# Altium schematic sheet USB_C.SchDoc
size A3; Organization: Altium Limited; Address1: L3, 12a Rodborough Rd; Address2: Frenchs Forest; Address3: NSW; Address4: Australia 2086
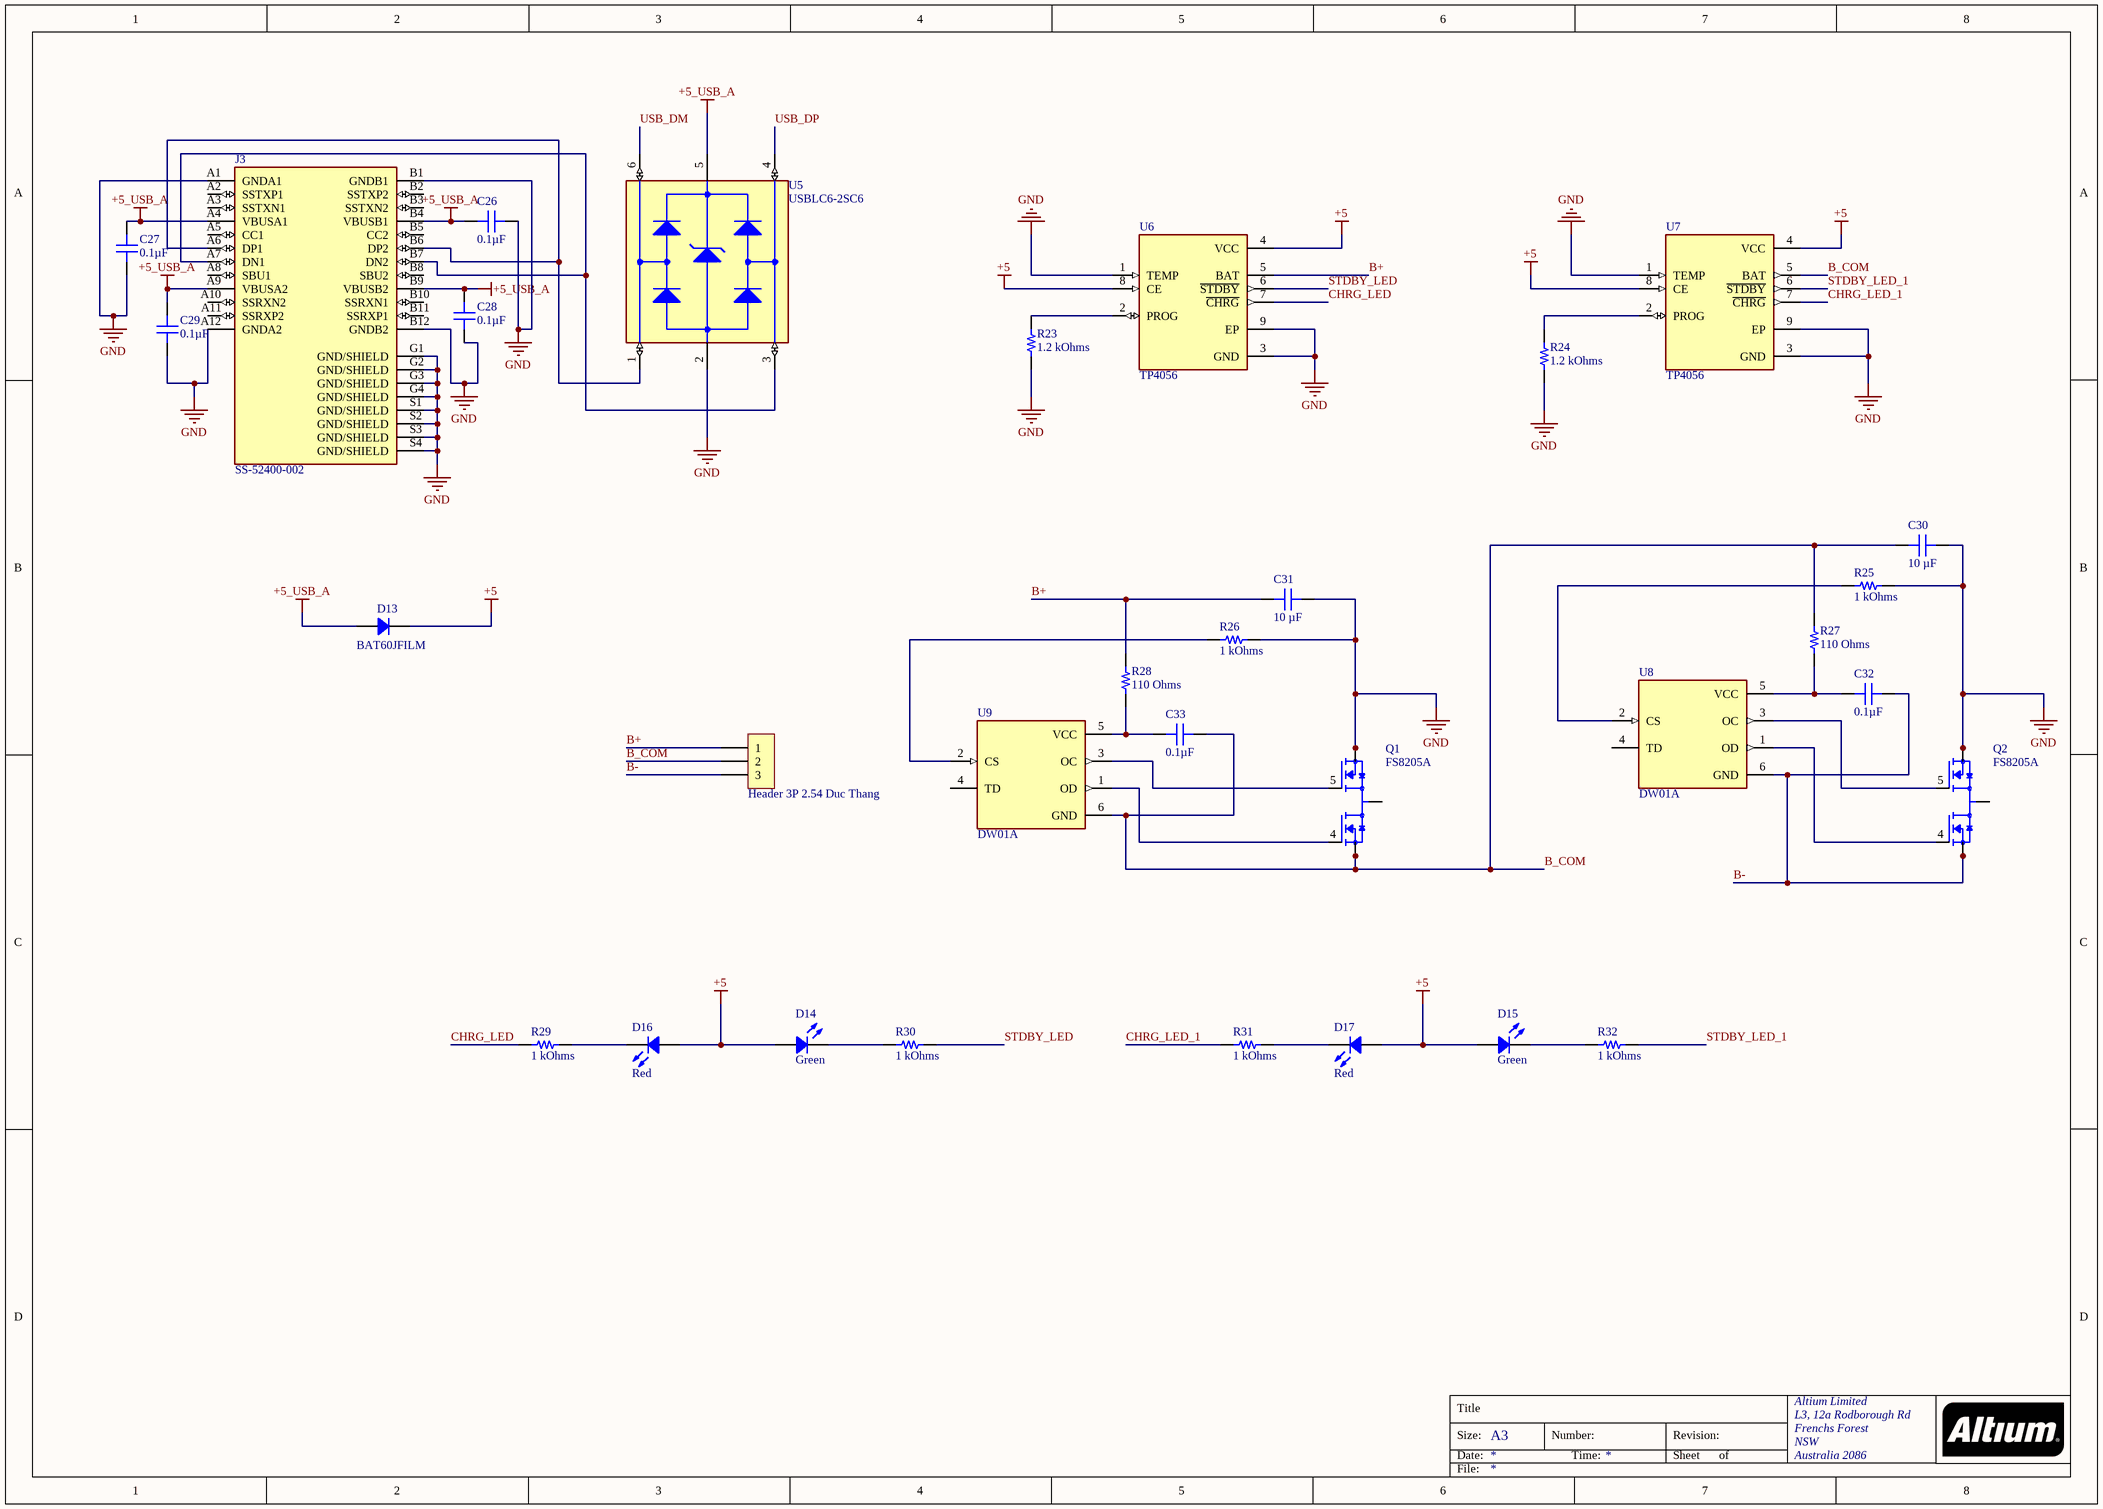
[diagram p0: USB_C.SchDoc]

## Parts
C26  0.1µF  [CAP 0603_1608]
C27  0.1µF  [CAP 0603_1608]
C28  0.1µF  [CAP 0603_1608]
C29  0.1µF  [CAP 0603_1608]
C30  10 µF  [CAP 0603_1608]
C31  10 µF  [CAP 0603_1608]
C32  0.1µF  [CAP 0603_1608]
C33  0.1µF  [CAP 0603_1608]
D13  BAT60JFILM  [SOD323]
D14  Green  [LED 0603_1608 GREEN]
D15  Green  [LED 0603_1608 GREEN]
D16  Red  [LED 0603_1608 RED]
D17  Red  [LED 0603_1608 RED]
H1  Header 3P 2.54 Duc Thang  [XH2.54M-3]
J3  SS-52400-002  [BELFUSE_SS-52400-002]
Q1  FS8205A  [SOP65P640X120-8N]
Q2  FS8205A  [SOP65P640X120-8N]
R23  1.2 kOhms  [RES 0402_1005]
R24  1.2 kOhms  [RES 0402_1005]
R25  1 kOhms  [RES 0603_1608]
R26  1 kOhms  [RES 0603_1608]
R27  110 Ohms  [RES 0603_1608]
R28  110 Ohms  [RES 0603_1608]
R29  1 kOhms  [RES 0603_1608]
R30  1 kOhms  [RES 0603_1608]
R31  1 kOhms  [RES 0603_1608]
R32  1 kOhms  [RES 0603_1608]
U5  USBLC6-2SC6  [SOT95P280X145-6N]
U6  TP4056  [SOP127P600X175-9N]
U7  TP4056  [SOP127P600X175-9N]
U8  DW01A  [SOT95P280X145-6N]
U9  DW01A  [SOT95P280X145-6N]

## Nets
+5: D13.2 D14.1 D15.1 D16.1 D17.1 U6.4(VCC) U6.8(CE) U7.4(VCC) U7.8(CE)
+5_USB_A: C26.2 C27.2 C28.2 C29.2 D13.1 J3.A4(VBUSA1) J3.A9(VBUSA2) J3.B4(VBUSB1) J3.B9(VBUSB2) U5.5(VBUS)
GND: C26.1 C27.1 C28.1 C29.1 C30.2 C31.2 J3.A1(GNDA1) J3.A12(GNDA2) J3.B1(GNDB1) J3.B12(GNDB2) J3.G1(GND/SHIELD) J3.G2(GND/SHIELD) J3.G3(GND/SHIELD) J3.G4(GND/SHIELD) J3.S1(GND/SHIELD) J3.S2(GND/SHIELD) J3.S3(GND/SHIELD) J3.S4(GND/SHIELD) Q1.6(S2) Q1.7(S2) Q2.6(S2) Q2.7(S2) R23.1 R24.1 R25.2 R26.2 U5.2(GND) U6.1(TEMP) U6.3(GND) U6.9(EP) U7.1(TEMP) U7.3(GND) U7.9(EP)
B+: C31.1 H1.1 R28.2 U6.5(BAT)
B-: C32.1 H1.3 Q2.2(S1) Q2.3(S1) U8.6(GND)
B_COM: C30.1 C33.1 H1.2 Q1.2(S1) Q1.3(S1) R27.2 U7.5(BAT) U9.6(GND)
CHRG_LED: R29.1 U6.7(~{CHRG})
CHRG_LED_1: R31.1 U7.7(~{CHRG})
STDBY_LED: R30.2 U6.6(~{STDBY})
STDBY_LED_1: R32.2 U7.6(~{STDBY})
USB_DM: U5.6(I/O1_OUT)
USB_DP: U5.4(I/O2_OUT)
NetC32_2: C32.2 R27.1 U8.5(VCC)
NetC33_2: C33.2 R28.1 U9.5(VCC)
NetD14_2: D14.2 R30.1
NetD15_2: D15.2 R32.1
NetD16_2: D16.2 R29.2
NetD17_2: D17.2 R31.2
NetJ3_A6: J3.A6(DP1) J3.B6(DP2) U5.1(I/O1_IN)
NetJ3_A7: J3.A7(DN1) J3.B7(DN2) U5.3(I/O2_IN)
NetQ1_1: Q1.1(D12) Q1.8(D12)
NetQ1_4: Q1.4(G1) U9.1(OD)
NetQ1_5: Q1.5(G2) U9.3(OC)
NetQ2_1: Q2.1(D12) Q2.8(D12)
NetQ2_4: Q2.4(G1) U8.1(OD)
NetQ2_5: Q2.5(G2) U8.3(OC)
NetR23_2: R23.2 U6.2(PROG)
NetR24_2: R24.2 U7.2(PROG)
NetR25_1: R25.1 U8.2(CS)
NetR26_1: R26.1 U9.2(CS)

Not connected (* = marked no-connect by the designer): J3 A2(SSTXP1) A3(SSTXN1) A5(CC1) A8(SBU1) A10(SSRXN2) A11(SSRXP2) B2(SSTXP2) B3(SSTXN2) B5(CC2) B8(SBU2) B10(SSRXN1) B11(SSRXP1); U8 4(TD); U9 4(TD)

## Notes on the sheet
- Title
- Size:
- Date:
- A3
- Number:
- Time:
- Revision:
- Sheet
- of
- File:

## Library data of the parts
C26-C29 C32 C33 = LD03YC104JAB2A: CAP CER 0.1UF 16V X7R 0603; manufacturer: AVX Corporation; Tolerance: ±5%; Part Number: LD03YC104JAB2A; Value: 0.1µF; Applications: General Purpose; Capacitance: 0.1µF; componentlink1description: Datasheet; componentlink1url: http://datasheets.avx.com/LD-Series.pdf; componentlink2description: DigiKey Link; componentlink2url: http://digikey.com/product-detail/en/avx-corporation/LD03YC104JAB2A/478-4928-1-ND/1858874; Device Package: 0603 (1608 Metric); lastupdated: 9/2/2020 1:03:21 AM; Lifecycle Status: Active; Minimum Order: 1; Mounting Type: Surface Mount, MLCC; Operating Temperature: -55°C ~ 125°C; Package / Case: 0603 (1608 Metric); packaging: TapeAndReel; partid: 10388; Part Status: Active; price: 0.19; series: LD; Size / Dimension: 0.063" L x 0.032" W (1.60mm x 0.81mm); Supplier 1: DigiKey; Supplier Part Number 1: 478-4928-1-ND; Temperature Coefficient: X7R; Thickness (Max): 0.035" (0.90mm); Voltage - Rated: 16V
C30 C31 = ZRB18AC81A106KE01L: CAP CER 10UF 10V X6S 0603; manufacturer: Murata Electronics; Tolerance: ±10%; Part Number: ZRB18AC81A106KE01L; Value: 10 µF; Applications: Acoustic Noise Reduction; Capacitance: 10 µF; componentlink1description: Datasheet; componentlink1url: https://search.murata.co.jp/Ceramy/image/img/A01X/G101/ENG/ZRB18AC81A106KE01-01.pdf; componentlink2description: DigiKey Link; componentlink2url: https://www.digikey.com/en/products/detail/murata-electronics/ZRB18AC81A106KE01L/5321077; Device Package: 0603 (1608 Metric); Features: Interposer Termination; lastupdated: 2/9/2024 8:10:29 PM; Lifecycle Status: Active; Minimum Order: 1; Mounting Type: Surface Mount, MLCC; Operating Temperature: -55°C ~ 105°C; Package / Case: 0603 (1608 Metric); packaging: TapeAndReel; partid: 3376; Part Status: Active; price: 0.09; series: ZRB; Size / Dimension: 0.063" L x 0.031" W (1.60mm x 0.80mm); Supplier 1: DigiKey; Supplier Part Number 1: 490-10985-1-ND; Temperature Coefficient: X6S; Thickness (Max): 0.047" (1.20mm); Voltage - Rated: 10V
D13 = BAT60JFILM: DIODE SCHOTTKY 10V 3A SOD323; Manufacturer: STMicroelectronics; Current - Reverse Leakage @ Vr: 6 µA @ 10 V; Speed: Fast Recovery =< 500ns, > 200mA (Io); Voltage - Forward (Vf) (Max) @ If: 580 mV @ 1 A; Part Number: BAT60JFILM; ComponentLink1Description: Datasheet; ComponentLink1URL: http://www.st.com/content/ccc/resource/technical/document/datasheet/3d/d2/27/1d/20/e3/4d/48/CD00001944.pdf/files/CD00001944.pdf/jcr:content/translations/en.CD00001944.pdf; ComponentLink2Description: DigiKey Link; ComponentLink2URL: https://www.digikey.com/en/products/detail/stmicroelectronics/BAT60JFILM/686386; Current - Average Rectified (Io): 3A; Diode Type: Schottky; LastUpdated: 6/3/2024 8:20:13 PM; Lifecycle Status: Active; Minimum Order: 1; Mounting Type: Surface Mount; Operating Temperature - Junction: 150°C (Max); Package / Case: SC-76, SOD-323; Packaging: TapeAndReel; PartId: 3091; Part Status: Active; Price: 0.04; Series: -; Supplier 1: DigiKey; Supplier Part Number 1: 497-3707-1-ND; Supplier Device Package: SOD-323; Voltage - DC Reverse (Vr) (Max): 10 V
D14 D15 = LT Q39G-Q1OO-25-1: LED GREEN DIFFUSED 0603 SMD; Manufacturer: OSRAM Opto Semiconductors Inc.; Configuration: Standard; Current - Test: 5mA; Lens Color: White; Lens Size: 1.10mm x 0.80mm; Lens Style: Rectangle with Flat Top; Millicandela Rating: 175.5mcd; Viewing Angle: 170°, 130°; Voltage - Forward (Vf) (Typ): 2.85V; Wavelength - Dominant: 530nm; Wavelength - Peak: 525nm; Part Number: LT Q39G-Q1OO-25-1; Color: Green; ComponentLink1Description: Datasheet; ComponentLink1URL: https://dammedia.osram.info/media/resource/hires/osram-dam-2493418/LT%20Q39G.pdf; ComponentLink2Description: DigiKey Link; ComponentLink2URL: https://www.digikey.com/en/products/detail/osram-opto-semiconductors-inc/LT-Q39G-Q1OO-25-1/2793416; Device Package: 0603 (1608 Metric); Height (Max): 0.40mm; LastUpdated: 6/3/2024 7:58:51 PM; Lens Transparency: Diffused; Lifecycle Status: Active; Minimum Order: 1; Mounting Type: Surface Mount; Package / Case: 0603 (1608 Metric); Packaging: TapeAndReel; PartId: 689; Part Status: Active; Price: 0.07; Series: CHIPLED 0603; Size / Dimension: 1.60mm L x 0.80mm W; Supplier 1: DigiKey; Supplier Part Number 1: 475-3442-1-ND; Supplier Device Package: 0603; Value: Green
D16 D17 = SML-D13U8WT86: LED RED 0603 SMD; Manufacturer: Rohm Semiconductor; Current - Test: 20mA; Lens Size: 1.20mm x 0.80mm; Lens Style: Rectangle with Flat Top; Millicandela Rating: 70mcd; Voltage - Forward (Vf) (Typ): 2.2V; Wavelength - Dominant: 620nm; Part Number: SML-D13U8WT86; Color: Red; ComponentLink1Description: Datasheet; ComponentLink1URL: https://fscdn.rohm.com/en/products/databook/datasheet/opto/led/chip_mono/sml-d12x8_d13x8-e.pdf; ComponentLink2Description: DigiKey Link; ComponentLink2URL: https://www.digikey.com/en/products/detail/rohm-semiconductor/SML-D13U8WT86/16285870; Device Package: 0603 (1608 Metric); Height (Max): 0.65mm; LastUpdated: 6/3/2024 7:59:44 PM; Lifecycle Status: Active; Minimum Order: 1; Mounting Type: Surface Mount; Package / Case: 0603 (1608 Metric); Packaging: TapeAndReel; PartId: 1127; Part Status: Active; Price: 0.10; Series: SML-D12x8/D13x8; Size / Dimension: 1.60mm L x 0.80mm W; Supplier 1: DigiKey; Supplier Part Number 1: 846-SML-D13U8WT86CT-ND; Supplier Device Package: 0603; Value: Red
H1 = Header 3P 2.54 Duc Thang: Cắm; Ten_Linh_Kien: Header 3P XH2.54-3P Đực Thẳng; Don_Vi: Con; Ma_Hang: MH001292; Chung_Loai: Cắm
J3 = SS-52400-002: USB Type-C Connector | 1 Port | Right Angle Receptacle | Shielded | 0.039[1.00mm]; MF: Stewart Connector; Package: None; Mouser-Purchase-URL: https://snapeda.com/shop?store=Mouser&id=4629247; Value: *; Price: None; DigiKey-Purchase-URL: https://snapeda.com/shop?store=DigiKey&id=4629247; MP: SS-52400-002; Availability: Warning; SnapEDA_Link: https://www.snapeda.com/parts/SS-52400-002/Stewart%20Connector/view-part/4629247/?ref=snap
Q1 Q2 = FS8205A: N/A; MF: Fortune Semiconductor; MP: FS8205A; Value: *; Availability: Not in stock; Package: Package; Price: None; SnapEDA_Link: https://www.snapeda.com/parts/FS8205A/Fortune+Semiconductor/view-part/?ref=snap; Check_prices: https://www.snapeda.com/parts/FS8205A/Fortune+Semiconductor/view-part/?ref=eda
R23 = ERJ-2RKF1201X: RES SMD 1.2K OHM 1% 1/10W 0402; Manufacturer: Panasonic Electronic Components; Power (Watts): 0.1W, 1/10W; Temperature Coefficient: ±100ppm/°C; Part Number: ERJ-2RKF1201X; Value: 1.2 kOhms; ComponentLink1Description: Datasheet; ComponentLink1URL: https://industrial.panasonic.com/cdbs/www-data/pdf/RDA0000/AOA0000C304.pdf; ComponentLink2Description: DigiKey Link; ComponentLink2URL: https://www.digikey.com/en/products/detail/panasonic-electronic-components/ERJ-2RKF1201X/1746119; Composition: Thick Film; Device Package: 0402 (1005 Metric); Features: Automotive AEC-Q200; Height - Seated (Max): 0.016" (0.40mm); LastUpdated: 2/9/2024 8:30:04 PM; Lifecycle Status: Active; Minimum Order: 1; Number of Terminations: 2; Operating Temperature: -55°C ~ 155°C; Package / Case: 0402 (1005 Metric); Packaging: CutTape; PartId: 7242; Part Status: Active; Price: 0.01; Ratings: AEC-Q200; Resistance: 1.2 kOhms; Series: ERJ-2RK; Size / Dimension: 0.039" L x 0.020" W (1.00mm x 0.50mm); Supplier 1: DigiKey; Supplier Part Number 1: P1.20KLCT-ND; Supplier Device Package: 0402; Tolerance: ±1%
R24 = MCS04020C1201FE000: RES SMD 1.2K OHM 1% 1/10W 0402; Manufacturer: Vishay Beyschlag; Power (Watts): 0.1W, 1/10W; Temperature Coefficient: ±50ppm/°C; Part Number: MCS04020C1201FE000; Value: 1.2 kOhms; ComponentLink1Description: Datasheet; ComponentLink1URL: http://www.vishay.com/docs/28705/mcx0x0xpro.pdf; ComponentLink2Description: DigiKey Link; ComponentLink2URL: http://digikey.com/product-detail/en/vishay-beyschlag/MCS04020C1201FE000/749-MCS04020C1201FE000CT-ND/10453885; Composition: Thin Film; Device Package: 0402 (1005 Metric); Features: Anti-Sulfur; Height - Seated (Max): 0.015" (0.37mm); LastUpdated: 2/9/2024 8:30:06 PM; Lifecycle Status: Active; Minimum Order: 1; Number of Terminations: 2; Operating Temperature: -55°C ~ 155°C; Package / Case: 0402 (1005 Metric); Packaging: TapeAndReel; PartId: 6712; Part Status: Active; Price: 0.03; Resistance: 1.2 kOhms; Series: MCS - Professional; Size / Dimension: 0.039" L x 0.020" W (1.00mm x 0.50mm); Supplier 1: DigiKey; Supplier Part Number 1: 749-MCS04020C1201FE000CT-ND; Supplier Device Package: 0402; Tolerance: ±1%
R25 R26 R29-R32 = M55342E12B1B00RWS: RES SMD 1K OHM 0.1% 1/10W 0603; Manufacturer: Vishay Dale Thin Film; Power (Watts): 0.1W, 1/10W; Temperature Coefficient: ±25ppm/°C; Part Number: M55342E12B1B00RWS; Value: 1 kOhms; ComponentLink1Description: Datasheet; ComponentLink1URL: https://www.vishay.com/docs/60018/eh.pdf; ComponentLink2Description: DigiKey Link; ComponentLink2URL: https://www.digikey.com/en/products/detail/vishay-dale-thin-film/M55342E12B1B00RWS/3578912; Composition: Thin Film; Device Package: 0603 (1608 Metric); Failure Rate: R (0.01%); Features: Military, Non-Inductive; Height - Seated (Max): 0.033" (0.84mm); LastUpdated: 2/9/2024 8:40:47 PM; Lifecycle Status: Active; Minimum Order: 1; Number of Terminations: 2; Operating Temperature: -55°C ~ 150°C; Package / Case: 0603 (1608 Metric); Packaging: Tray; PartId: 75435; Part Status: Active; Price: 8.97; Resistance: 1 kOhms; Series: Military, MIL-PRF-55342, RM0603; Size / Dimension: 0.064" L x 0.032" W (1.63mm x 0.81mm); Supplier 1: DigiKey; Supplier Part Number 1: 764-M55342E12B1B00RWS-ND; Supplier Device Package: 0603; Tolerance: ±0.1%
R27 R28 = ERJ-PA3F1100V: RES SMD 110 OHM 1% 1/3W 0603; Manufacturer: Panasonic Electronic Components; Power (Watts): 0.333W, 1/3W; Temperature Coefficient: ±100ppm/°C; Part Number: ERJ-PA3F1100V; Value: 110 Ohms; ComponentLink1Description: Datasheet; ComponentLink1URL: https://industrial.panasonic.com/cdbs/www-data/pdf/RDO0000/AOA0000C331.pdf; ComponentLink2Description: DigiKey Link; ComponentLink2URL: https://www.digikey.com/en/products/detail/panasonic-electronic-components/ERJ-PA3F1100V/5035853; Composition: Thick Film; Device Package: 0603 (1608 Metric); Features: Automotive AEC-Q200, Pulse Withstanding; Height - Seated (Max): 0.022" (0.55mm); LastUpdated: 2/9/2024 8:43:28 PM; Lifecycle Status: Active; Minimum Order: 1; Number of Terminations: 2; Operating Temperature: -55°C ~ 155°C; Package / Case: 0603 (1608 Metric); Packaging: TapeAndReel; PartId: 7062; Part Status: Active; Price: 0.01; Ratings: AEC-Q200; Resistance: 110 Ohms; Series: ERJ-PA3; Size / Dimension: 0.063" L x 0.031" W (1.60mm x 0.80mm); Supplier 1: DigiKey; Supplier Part Number 1: P110BYCT-ND; Supplier Device Package: 0603; Tolerance: ±1%
U5 = USBLC6-2SC6: 17V Clamp 5A (8/20Âµs) Ipp Tvs Diode Surface Mount SOT-23-6; MF: STMicroelectronics; SnapEDA_Link: https://www.snapeda.com/parts/USBLC6-2SC6/STMicroelectronics/view-part/?ref=snap; Package: SOT-23-6 STMicroelectronics; Value: *; MP: USBLC6-2SC6; Check_prices: https://www.snapeda.com/parts/USBLC6-2SC6/STMicroelectronics/view-part/?ref=eda
U6 U7 = TP4056: Complete single cell Li-Ion battery with a constant current / constant voltage linear charger; MF: NanJing Top Power ASIC Corp.; Check_prices: https://www.snapeda.com/parts/TP4056/NanJing+Top+Power+ASIC+Corp./view-part/?ref=eda; SnapEDA_Link: https://www.snapeda.com/parts/TP4056/NanJing+Top+Power+ASIC+Corp./view-part/?ref=snap; Price: None; Availability: Not in stock; Package: Package; MP: TP4056; Value: *
U8 U9 = DW01A: One Cell Lithium-ion/Polymer Battery Protection IC; MF: Fortune Semiconductor; SnapEDA_Link: https://www.snapeda.com/parts/DW01A/Fortune+Semiconductor/view-part/?ref=snap; Package: SOT-23-6 Fortune Semiconductor; Value: *; MP: DW01A; Check_prices: https://www.snapeda.com/parts/DW01A/Fortune+Semiconductor/view-part/?ref=eda